# Altium schematic sheet 电路.SchDoc
size A4
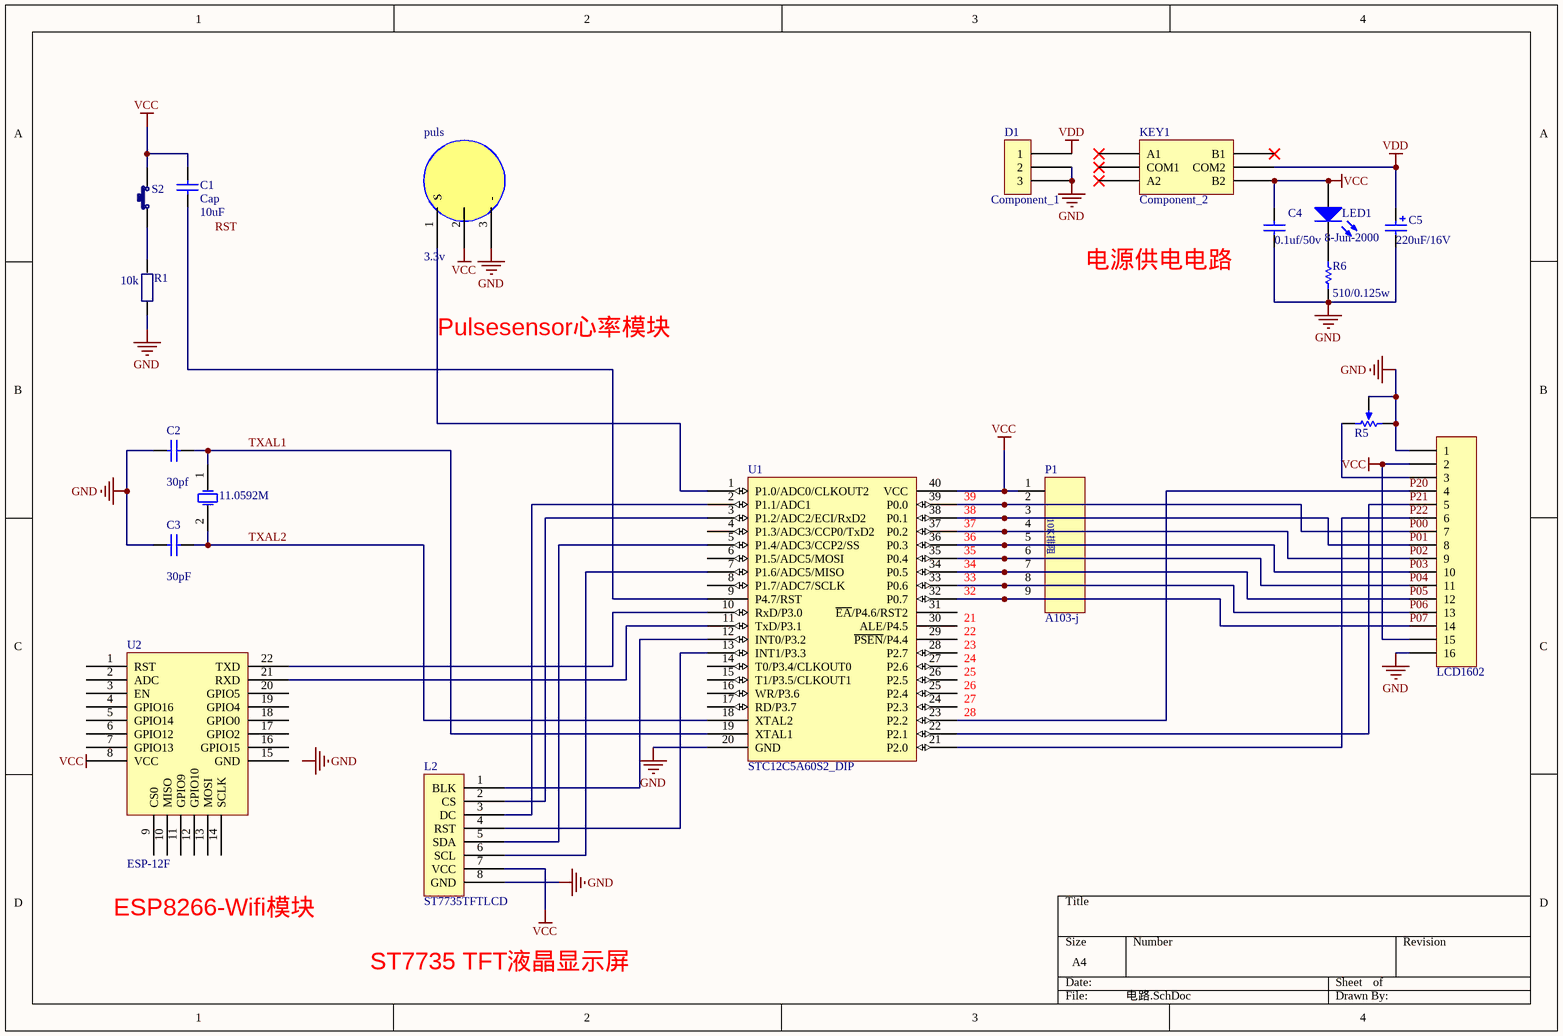
[diagram p0: 电路.SchDoc]

## Parts
11.0592M  晶振  [XTAL-49/U_N]  (value not drawn)
C1  Cap  value 10uF  [CAP-0.1]
C2  value 30pf  [CAP-0.1]
C3  value 30pF  [CAP-0.1]
C4  value 0.1uf/50v  [CAP-0.1]  (hidden comment: Cap)
C5  value 220uF/16V  [Capacitor-Disk-Middle]  (hidden comment: Cap Pol2)
D1  Component_1  [接插件_DC端口]
KEY1  Component_2  [sw_8.5mm]
L1  LCD1602  [HDR1X16]
L2  ST7735TFTLCD  [HDR1X8]
LED1  LED Chip  [CLED1005-0402]  (value not drawn)
P1  A103-j  [HDR1X9]
puls  3.3v  [HDR1X3]
R1  value 10k  [AXIAL-0.5-R]  (hidden comment: Resistor 贴片)
R5  RPot  [VR5]  (value not drawn)
R6  value 510/0.125w  Published: 8-Jun-2000  [AXIAL-0.3]  (hidden comment: Res1)
S2  弹性小按键  [BUTTON_6*6]  (value not drawn)
U1  STC12C5A60S2_DIP  [dip40 - 紧缩座]
U2  ESP-12F  [ESP-12F]

## Nets
GND: C2.1 C3.1 C4.1 C5.2 D1.2 D1.3 L1.1 L1.16 L2.8(GND) puls.3(-) R1.1 R5.1(TOP) R5.2(TAP) R6.1 U1.20(GND)
VCC: C1.2 C4.2 KEY1.6(B2) L1.2 L1.15 L2.7(VCC) LED1.1(A) P1.1 puls.2 S2.2 U1.40(VCC)
VDD: C5.1 D1.1 KEY1.5(COM2)
28: L1.4 U1.23(P2.2)  [also labelled P20]
32: L1.14 P1.9 U1.32(P0.7)  [also labelled P07]
33: L1.13 P1.8 U1.33(P0.6)  [also labelled P06]
34: L1.12 P1.7 U1.34(P0.5)  [also labelled P05]
35: L1.11 P1.6 U1.35(P0.4)  [also labelled P04]
36: L1.10 P1.5 U1.36(P0.3)  [also labelled P03]
37: L1.9 P1.4 U1.37(P0.2)  [also labelled P02]
38: L1.8 P1.3 U1.38(P0.1)  [also labelled P01]
39: L1.7 P1.2 U1.39(P0.0)  [also labelled P00]
P21: L1.5 U1.22(P2.1)
P22: L1.6 U1.21(P2.0)
TXAL1: 11.0592M.1(OSC1) C2.2 U1.19(XTAL1)
TXAL2: 11.0592M.2(OSC2) C3.2 U1.18(XTAL2)
NetC1_1: C1.1 U1.9(P4.7/RST)
NetL1_3: L1.3 R5.3(BOT)
NetL2_1: L2.1(BLK) U1.12(INT0/P3.2)
NetL2_2: L2.2(CS) U1.3(P1.2/ADC2/ECI/RxD2)
NetL2_3: L2.3(DC) U1.2(P1.1/ADC1)
NetL2_4: L2.4(RST) U1.13(INT1/P3.3)
NetL2_5: L2.5(SDA) U1.5(P1.4/ADC3/CCP2/SS)
NetL2_6: L2.6(SCL) U1.7(P1.6/ADC5/MISO)
NetLED1_2: LED1.2(K) R6.2
Netpuls_1: puls.1(S) U1.1(P1.0/ADC0/CLKOUT2)
NetR1_2: R1.2 S2.1
NetU1_10: U1.10(RxD/P3.0) U2.22(TXD)
NetU1_11: U1.11(TxD/P3.1) U2.21(RXD)

Not connected (* = marked no-connect by the designer): KEY1 1(A1)* 2(COM1)* 3(A2)* 4(B1)*; U1 4(P1.3/ADC3/CCP0/TxD2) 6(P1.5/ADC5/MOSI) 8(P1.7/ADC7/SCLK) 14(T0/P3.4/CLKOUT0) 15(T1/P3.5/CLKOUT1) 16(WR/P3.6) 17(RD/P3.7) 24(P2.3) 25(P2.4) 26(P2.5) 27(P2.6) 28(P2.7) 29(~{PSEN}/P4.4) 30(ALE/P4.5) 31(~{EA}/P4.6/RST2); U2 1(RST) 2(ADC) 3(EN) 4(GPIO16) 5(GPIO14) 6(GPIO12) 7(GPIO13) 8(VCC) 9(CS0) 10(MISO) 11(GPIO9) 12(GPIO10) 13(MOSI) 14(SCLK) 15(GND) 16(GPIO15) 17(GPIO2) 18(GPIO0) 19(GPIO4) 20(GPIO5)

## Notes on the sheet
- 电源供电电路
- Pulsesensor心率模块
- ESP8266-Wifi模块
- ST7735 TFT液晶显示屏
- Labels drawn without touching a wire or pin: 21, 22, 23, 24, 25, 26, 27, GND, RST, VCC
- (in symbol A103-j) 10K排阻

## Library data of the parts
C1-C4 = Cap: Capacitor; Published: 8-Jun-2000; LatestRevisionDate: 17-Jul-2002; LatestRevisionNote: Re-released for DXP Platform.; PackageReference: RAD-0.3; Publisher: Altium Limited; PackageDescription: Radial Cap, Thru-Hole; 2 Leads; 0.3 in Pin Spacing
C5 = Cap Pol2: Polarized Capacitor (Axial); Published: 8-Jun-2000; LatestRevisionDate: 17-Jul-2002; LatestRevisionNote: Re-released for DXP Platform.; PackageReference: POLAR0.8; Publisher: Altium Limited; PackageDescription: Polarized Capacitor; 2 Leads
KEY1 = Component_1
L1 = Header 16: Header, 16-Pin; LatestRevisionDate: 17-Jul-2002; LatestRevisionNote: Re-released for DXP Platform.; Publisher: Altium Limited
LED1 = LED Chip: Typical Chip LED; Published: 8-Jun-2000; Revision: July-2002: Re-released for DXP Platform.; Publisher: Altium Limited
puls = puls
R5 = RPot: Potentiometer; Sim Note: Enter the Resistance value and the set point into parameter fields.; Set Position: 0.5; Value: 1K; Published: 8-Jun-2000; LatestRevisionDate: 17-Jul-2002; LatestRevisionNote: Re-released for DXP Platform.; PackageReference: VR5; Publisher: Altium Limited
R6 = Res1: Resistor; LatestRevisionDate: 17-Jul-2002; LatestRevisionNote: Re-released for DXP Platform.; PackageReference: AXIAL-0.3; Publisher: Altium Limited; PackageDescription: Axial Device, Thru-Hole; 2 Leads; 0.3 in Pin Spacing
U2 = ESP-12F: wifi芯片，ESP8266串口WIFI; 购买参考链接: https://item.taobao.com/item.htm?spm=a1z10.3-c-s.w4002-16248799899.48.e2eb546eHCQD5R&id=45081050416